# Altium schematic sheet usb_2_0.SchDoc
size A4
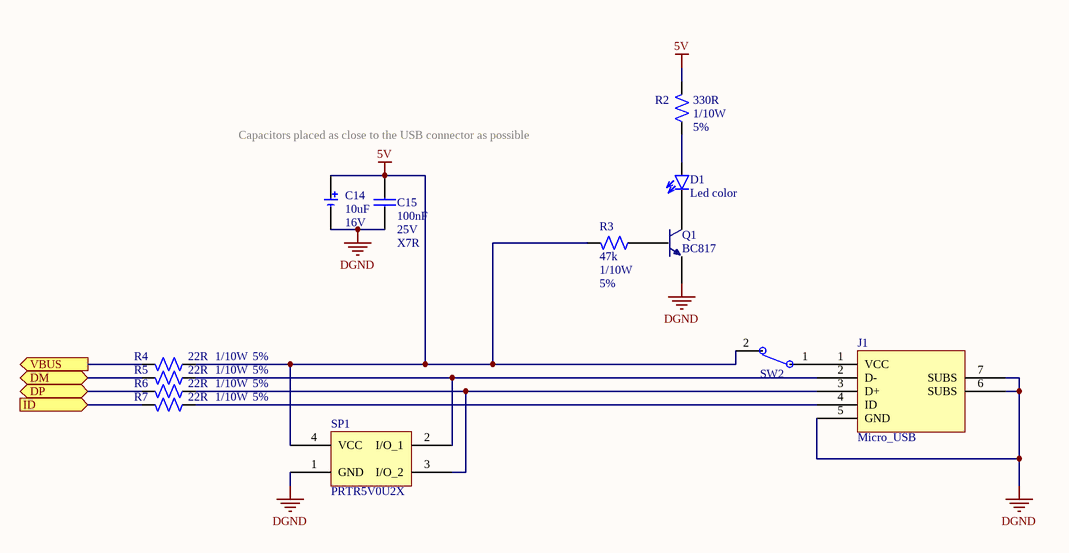
[diagram p0: usb_2_0.SchDoc]

## Parts
C14  Valor: 10uF  tension: 16V  [CAP_Electrolytic]  (hidden comment: Capacitor polarizado)
C15  valor: 100nF  tension: 25V  tolerancia: X7R  [C0805]  (hidden comment: Capacitor)
D1  Led color  [SMD_0805_Diodo]
J1  Micro_USB  [USB Type B]
Q1  BC817  [SOT23]
R2  Valor: 330R  Potencia: 1/10W  Tolerancia: 5%  [R0805]  (hidden comment: Resistor)
R3  Valor: 47k  Potencia: 1/10W  Tolerancia: 5%  [R0805]  (hidden comment: Resistor)
R4  Valor: 22R  Potencia: 1/10W  Tolerancia: 5%  [R0805]  (hidden comment: Resistor)
R5  Valor: 22R  Potencia: 1/10W  Tolerancia: 5%  [R0805]  (hidden comment: Resistor)
R6  Valor: 22R  Potencia: 1/10W  Tolerancia: 5%  [R0805]  (hidden comment: Resistor)
R7  Valor: 22R  Potencia: 1/10W  Tolerancia: 5%  [R0805]  (hidden comment: Resistor)
SP1  PRTR5V0U2X  [SOT143B]
SW2  OnOff_SW_SPST  [SPST_TH_SW_Button_90º]  (value not drawn)

## Ports
DM (bidir), DP (bidir), ID (in), VBUS (out)

## Nets
5V: C14.1 C15.1 R2.2 R3.2 R4.1 SP1.4(VCC) SW2.2
DGND: C14.2 C15.2 J1.5(GND) J1.6(SUBS) J1.7(SUBS) Q1.2 SP1.1(GND)
DM: R5.2 ; port DM
DP: R6.2 ; port DP
ID: R7.2 ; port ID
VBUS: R4.2 ; port VBUS
NetD1_1: D1.1 Q1.3
NetD1_2: D1.2 R2.1
NetJ1_1: J1.1(VCC) SW2.1
NetJ1_2: J1.2(D-) R5.1 SP1.2(I/O_1)
NetJ1_3: J1.3(D+) R6.1 SP1.3(I/O_2)
NetJ1_4: J1.4(ID) R7.1
NetQ1_1: Q1.1 R3.1

## Notes on the sheet
- Capacitors placed as close to the USB connector as possible

## Library data of the parts
C15 = Capacitor: Capacitor de placas paralelas; Encapsulado: 0805
D1 = Led: Encapsulado: SMD; Cod. Proveedor: 67-1549-1-ND; Proveedor: Digi-Key; Color: Verde; Link: https://www.digikey.com/product-detail/es/SML-LX0603GW-TR/67-1549-1-ND/304360?utm_campaign=buynow&WT.z_cid=ref_octopart_dkc_buynow&utm_medium=aggregator&curr=usd&site=us&utm_source=octopart
J1 = Micro_USB: Conector micro USB tipo B; pin to pad: 7>6; Cod. Proveedor: CO4821095; Proveedor: Elemon; Encapsulado: SMD B TYPE SIDE ENTRY; Fabricante: *; Link: *
Q1 = NPN: Cod. Proveedor: 1727-2918-1-ND; Encapsulado: TO-236AB; Proveedor: Digi-Key; Fabricante: Nexperia USA Inc.; Link: https://www.digikey.com/products/es?keywords=1727-2918-1-ND
R2-R7 = Resistor: Resistencia
SP1 = Double ESD: Double rail-to-rail ESD protection diode; Cod. Proveedor: 1727-3884-1-ND; Proveedor: Digi-Key; Encapsulado: SOT-143B; Link: https://www.digikey.com/product-detail/es/PRTR5V0U2X,215/1727-3884-1-ND/1589981?utm_campaign=buynow&WT.z_cid=ref_octopart_dkc_buynow&utm_medium=aggregator&curr=usd&site=us&utm_source=octopart
SW2 = OnOff_SW_SPST: Cod. Proveedor: EG2615-ND; Encapsulado: SMD; Proveedor: Digi-Key; Fabricante: E-Switch; Link: https://www.digikey.com/product-detail/en/e-switch/800SP9B6M6RE/EG2615-ND/502079
C14 = Capacitor polarizado: Link: *; Fabricante: *